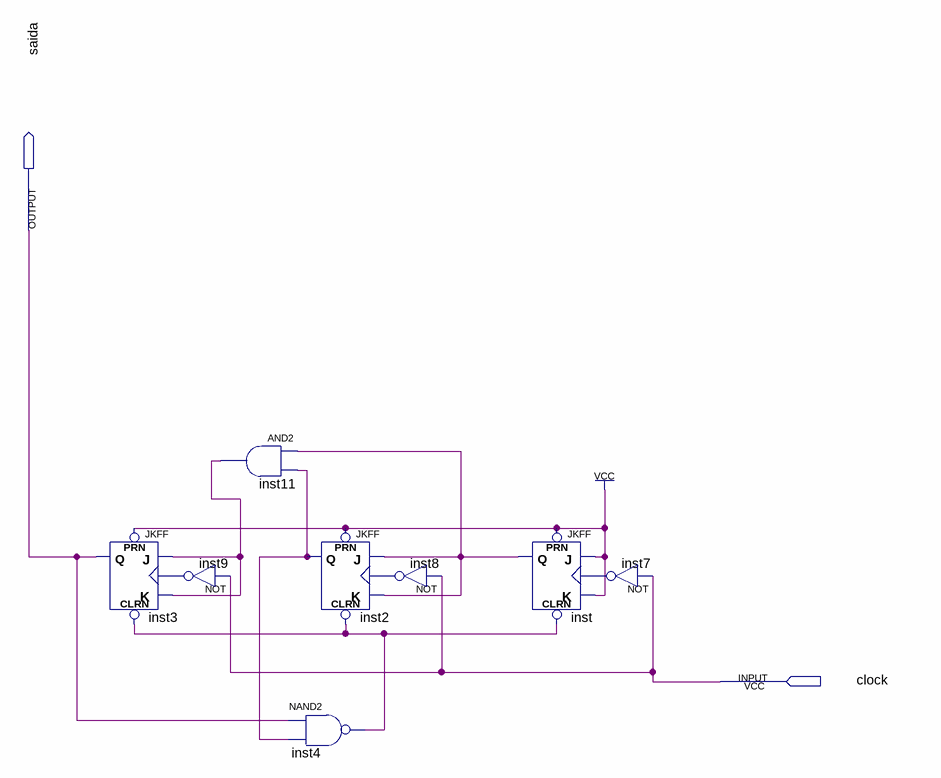
[diagram p0: schematic sheet]
// Quartus schematic divisor5.bdf as structural Verilog: 8 symbols, 2 pins
module divisor5 (
  input  clock,
  output saida
);

  wire inst2_q, inst4_out, inst7_out, inst8_out, inst9_out, inst11_out, inst_q;

  JKFF inst3 (.PRN(1'b1), .CLRN(inst4_out), .K(inst11_out), .J(inst11_out), .CLK(inst9_out), .Q(saida));
  not inst9 (inst9_out, clock);
  and inst11 (inst11_out, inst_q, inst2_q);
  JKFF inst2 (.PRN(1'b1), .CLRN(inst4_out), .K(inst_q), .J(inst_q), .CLK(inst8_out), .Q(inst2_q));
  nand inst4 (inst4_out, saida, inst2_q);
  not inst8 (inst8_out, clock);
  JKFF inst (.PRN(1'b1), .CLRN(inst4_out), .K(1'b1), .J(1'b1), .CLK(inst7_out), .Q(inst_q));
  not inst7 (inst7_out, clock);
endmodule
